# Altium schematic sheet Resolver.SchDoc
size A3
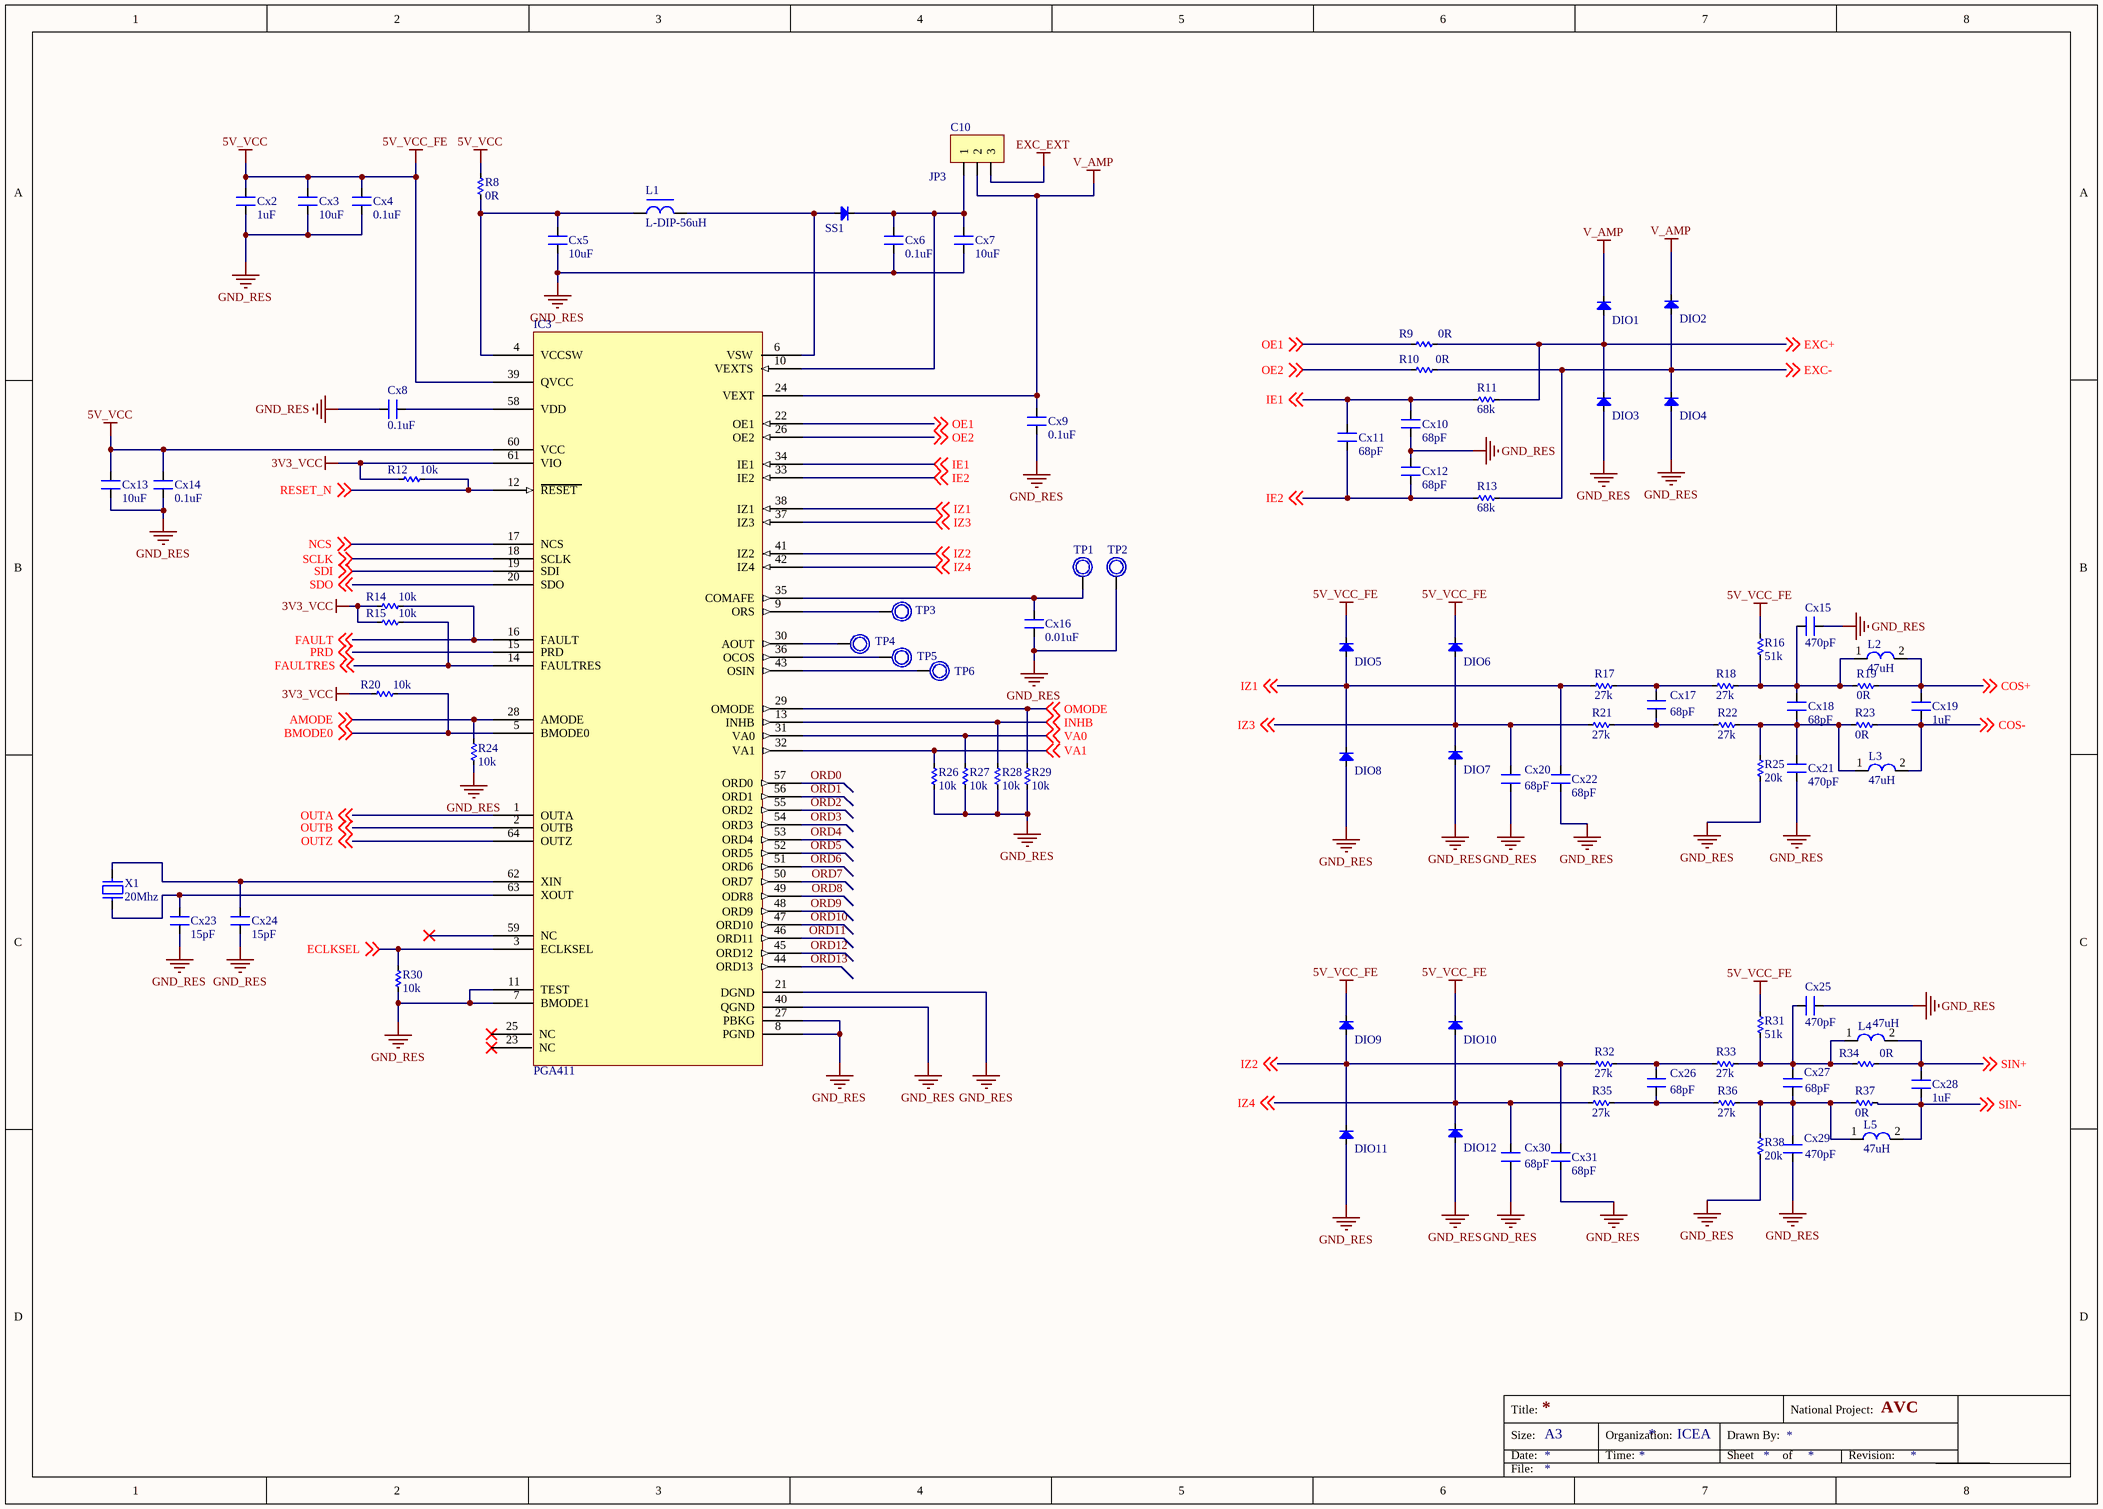
[diagram p0: Resolver.SchDoc]

## Parts
C10  JP3  [JP3-CLOSED]
Cx2  1uF  [CN-SMD-0805]
Cx3  10uF  [CN-SMD-1206]
Cx4  0.1uF  [CN-SMD-0805]
Cx5  10uF  [CN-SMD-1206]
Cx6  0.1uF  [CN-SMD-0805]
Cx7  10uF  [CN-SMD-1206]
Cx8  0.1uF  [CN-SMD-0805]
Cx9  0.1uF  [CN-SMD-0805]
Cx10  68pF  [CN-SMD-0805]
Cx11  68pF  [CN-SMD-0805]
Cx12  68pF  [CN-SMD-0805]
Cx13  10uF  [CN-SMD-1206]
Cx14  0.1uF  [CN-SMD-0805]
Cx15  470pF  [CN-SMD-0805]
Cx16  0.01uF  [CN-SMD-0805]
Cx17  68pF  [CN-SMD-0805]
Cx18  68pF  [CN-SMD-0805]
Cx19  1uF  [CN-SMD-0805]
Cx20  68pF  [CN-SMD-0805]
Cx21  470pF  [CN-SMD-0805]
Cx22  68pF  [CN-SMD-0805]
Cx23  15pF  [CN-SMD-0805]
Cx24  15pF  [CN-SMD-0805]
Cx25  470pF  [CN-SMD-0805]
Cx26  68pF  [CN-SMD-0805]
Cx27  68pF  [CN-SMD-0805]
Cx28  1uF  [CN-SMD-0805]
Cx29  470pF  [CN-SMD-0805]
Cx30  68pF  [CN-SMD-0805]
Cx31  68pF  [CN-SMD-0805]
DIO1  Diode SMD  [DIO-SMD-106]  (value not drawn)
DIO2  Diode SMD  [DIO-SMD-106]  (value not drawn)
DIO3  Diode SMD  [DIO-SMD-106]  (value not drawn)
DIO4  Diode SMD  [DIO-SMD-106]  (value not drawn)
DIO5  Diode SMD  [DIO-SMD-106]  (value not drawn)
DIO6  Diode SMD  [DIO-SMD-106]  (value not drawn)
DIO7  Diode SMD  [DIO-SMD-106]  (value not drawn)
DIO8  Diode SMD  [DIO-SMD-106]  (value not drawn)
DIO9  Diode SMD  [DIO-SMD-106]  (value not drawn)
DIO10  Diode SMD  [DIO-SMD-106]  (value not drawn)
DIO11  Diode SMD  [DIO-SMD-106]  (value not drawn)
DIO12  Diode SMD  [DIO-SMD-106]  (value not drawn)
IC3  PGA411  [PGA411]
L1  L-DIP-56uH  [L-DIP-M-13.5x6]
L2  47uH  [L CD43]
L3  47uH  [L CD43]
L4  47uH  [L CD43]
L5  47uH  [L CD43]
R8  0R  [RES-SMD-0805]
R9  0R  [RES-SMD-0805]
R10  0R  [RES-SMD-0805]
R11  68k  [RES-SMD-0805]
R12  10k  [RES-SMD-0805]
R13  68k  [RES-SMD-0805]
R14  10k  [RES-SMD-0805]
R15  10k  [RES-SMD-0805]
R16  51k  [RES-SMD-0805]
R17  27k  [RES-SMD-0805]
R18  27k  [RES-SMD-0805]
R19  0R  [RES-SMD-0805]
R20  10k  [RES-SMD-0805]
R21  27k  [RES-SMD-0805]
R22  27k  [RES-SMD-0805]
R23  0R  [RES-SMD-0805]
R24  10k  [RES-SMD-0805]
R25  20k  [RES-SMD-0805]
R26  10k  [RES-SMD-0805]
R27  10k  [RES-SMD-0805]
R28  10k  [RES-SMD-0805]
R29  10k  [RES-SMD-0805]
R30  10k  [RES-SMD-0805]
R31  51k  [RES-SMD-0805]
R32  27k  [RES-SMD-0805]
R33  27k  [RES-SMD-0805]
R34  0R  [RES-SMD-0805]
R35  27k  [RES-SMD-0805]
R36  27k  [RES-SMD-0805]
R37  0R  [RES-SMD-0805]
R38  20k  [RES-SMD-0805]
SS1  Diode SMD  [DIO-SMD-106]  (value not drawn)
TP1  TP  [Test Point]  (value not drawn)
TP2  TP  [Test Point]  (value not drawn)
TP3  TP  [Test Point]  (value not drawn)
TP4  TP  [Test Point]  (value not drawn)
TP5  TP  [Test Point]  (value not drawn)
TP6  TP  [Test Point]  (value not drawn)
X1  20Mhz  [XT2 SMD]

## Nets
3V3_VCC: IC3.61(VIO) R12.2 R14.2 R15.2 R20.2
5V_VCC: Cx2.2 Cx3.2 Cx4.2 Cx13.2 Cx14.2 DIO5.2(K) DIO6.2(K) DIO9.2(K) DIO10.2(K) IC3.39(QVCC) IC3.60(VCC) R8.1 R16.1 R31.1  [also labelled 5V_VCC_FE]
EXC_EXT: C10.3
GND_RES: Cx2.1 Cx3.1 Cx4.1 Cx5.1 Cx6.1 Cx7.1 Cx8.2 Cx9.1 Cx10.1 Cx12.2 Cx13.1 Cx14.1 Cx15.1 Cx16.1 Cx20.1 Cx21.1 Cx22.2 Cx23.1 Cx24.1 Cx25.1 Cx29.1 Cx30.1 Cx31.2 DIO3.1(A) DIO4.1(A) DIO7.1(A) DIO8.1(A) DIO11.1(A) DIO12.1(A) IC3.7(BMODE1) IC3.8(PGND) IC3.11(TEST) IC3.21(DGND) IC3.27(PBKG) IC3.40(QGND) R24.2 R25.2 R26.2 R27.2 R28.2 R29.2 R30.2 R38.2 TP2.1
V_AMP: C10.2 Cx9.2 DIO1.2(K) DIO2.2(K) IC3.24(VEXT)
AMODE: IC3.28(AMODE) R24.1 ; off-sheet AMODE
BMODE0: IC3.5(BMODE0) R20.1 ; off-sheet BMODE0
COS+: Cx19.2 L2.2 R19.1 ; off-sheet COS+
COS-: Cx19.1 L3.2 R23.1 ; off-sheet COS-
ECLKSEL: IC3.3(ECLKSEL) R30.1 ; off-sheet ECLKSEL
EXC+: DIO1.1(A) DIO3.2(K) R9.1 R11.1 ; off-sheet EXC+
EXC-: DIO2.1(A) DIO4.2(K) R10.1 R13.1 ; off-sheet EXC-
FAULT: IC3.16(FAULT) R14.1 ; off-sheet FAULT
FAULTRES: IC3.14(FAULTRES) R15.1 ; off-sheet FAULTRES
IE1: Cx10.2 Cx11.2 IC3.34(IE1) R11.2 ; off-sheet IE1
IE2: Cx11.1 Cx12.1 IC3.33(IE2) R13.2 ; off-sheet IE2
INHB: IC3.13(INHB) R28.1 ; off-sheet INHB
IZ1: Cx22.1 DIO5.1(A) DIO8.2(K) IC3.38(IZ1) R17.2 ; off-sheet IZ1
IZ2: Cx31.1 DIO9.1(A) DIO11.2(K) IC3.41(IZ2) R32.2 ; off-sheet IZ2
IZ3: Cx20.2 DIO6.1(A) DIO7.2(K) IC3.37(IZ3) R21.2 ; off-sheet IZ3
IZ4: Cx30.2 DIO10.1(A) DIO12.2(K) IC3.42(IZ4) R35.2 ; off-sheet IZ4
NCS: IC3.17(NCS) ; off-sheet NCS
OE1: IC3.22(OE1) R9.2 ; off-sheet OE1
OE2: IC3.26(OE2) R10.2 ; off-sheet OE2
OMODE: IC3.29(OMODE) R29.1 ; off-sheet OMODE
ORD0: IC3.57(ORD0)
ORD1: IC3.56(ORD1)
ORD2: IC3.55(ORD2)
ORD3: IC3.54(ORD3)
ORD4: IC3.53(ORD4)
ORD5: IC3.52(ORD5)
ORD6: IC3.51(ORD6)
ORD7: IC3.50(ORD7)
ORD8: IC3.49(ODR8)
ORD9: IC3.48(ORD9)
ORD10: IC3.47(ORD10)
ORD11: IC3.46(ORD11)
ORD12: IC3.45(ORD12)
ORD13: IC3.44(ORD13)
OUTA: IC3.1(OUTA) ; off-sheet OUTA
OUTB: IC3.2(OUTB) ; off-sheet OUTB
OUTZ: IC3.64(OUTZ) ; off-sheet OUTZ
PRD: IC3.15(PRD) ; off-sheet PRD
RESET_N: IC3.12(RESET) R12.1 ; off-sheet RESET_N
SCLK: IC3.18(SCLK) ; off-sheet SCLK
SDI: IC3.19(SDI) ; off-sheet SDI
SDO: IC3.20(SDO) ; off-sheet SDO
SIN+: Cx28.2 L4.2 R34.1 ; off-sheet SIN+
SIN-: Cx28.1 L5.2 R37.1 ; off-sheet SIN-
VA0: IC3.31(VA0) R27.1 ; off-sheet VA0
VA1: IC3.32(VA1) R26.1 ; off-sheet VA1
NetC10_1: C10.1 Cx6.2 Cx7.2 IC3.10(VEXTS) SS1.2(K)
NetCx5_2: Cx5.2 IC3.4(VCCSW) L1.1 R8.2
NetCx8_1: Cx8.1 IC3.58(VDD)
NetCx15_2: Cx15.2 Cx18.2 L2.1 R16.2 R18.1 R19.2
NetCx16_2: Cx16.2 IC3.35(COMAFE) TP1.1
NetCx17_1: Cx17.1 R21.1 R22.2
NetCx17_2: Cx17.2 R17.1 R18.2
NetCx18_1: Cx18.1 Cx21.2 L3.1 R22.1 R23.2 R25.1
NetCx23_2: Cx23.2 IC3.63(XOUT) X1.1
NetCx24_2: Cx24.2 IC3.62(XIN) X1.2
NetCx25_2: Cx25.2 Cx27.2 L4.1 R31.2 R33.1 R34.2
NetCx26_1: Cx26.1 R35.1 R36.2
NetCx26_2: Cx26.2 R32.1 R33.2
NetCx27_1: Cx27.1 Cx29.2 L5.1 R36.1 R37.2 R38.1
NetIC3_6: IC3.6(VSW) L1.2 SS1.1(A)
NetIC3_9: IC3.9(ORS) TP3.1
NetIC3_30: IC3.30(AOUT) TP4.1
NetIC3_36: IC3.36(OCOS) TP5.1
NetIC3_43: IC3.43(OSIN) TP6.1

Not connected (* = marked no-connect by the designer): IC3 23(NC)* 25(NC)* 59(NC)*

## Notes on the sheet
- Title:
- Size:
- Date:
- A3
- Organization:
- Time:
- ICEA
- Sheet
- Drawn By:
- of
- National Project:
- Revision:
- AVC
- File:

## Library data of the parts
C10 = JP3: WR-PHD 2.54 mm Angled Socket Header; Manufacturer: W¨¹rth Elektronik eiSos GmbH; partNo: 613003143121; ComponentLink1 Description: Manufacturer; ComponentLink2 Description: Datasheet; NoPins: 03; Created Date: 29 March 2013; ComponentLink1URL: http://www.we-online.com; ComponentLink2URL: http://katalog.we-online.de/em/datasheet/6130xx143121.pdf; Created by: Karrer Zheng
Cx2-Cx31 = CN: Value: 33pF
DIO1-DIO12 SS1 = Diode SMD: Default Diode; Code - JEDEC: DO-214-AB; Value: 1N5007; Published: 8-Jun-2000; Revision: July-2002: Re-released for DXP Platform.; Publisher: Altium Limited
L1 = L-DIP-1: Inductor; Value: 150 mH
L2-L5 = L-SMD-1: partNo: 78477010; Manufacturer: Wurth Elektronik; Inductance: 1.0 μH; ComponentLink1Description: Manufacturer; ComponentLink1URL: http://www.we-online.de; Created by: Baojun Chen; Created Date: Nov.2015; ComponentLink2Description: Datasheet; ComponentLink2URL: http://katalog.we-online.de/pbs/datasheet/78477010.pdf
R8-R38 = Res-SMD: Resistor; Manufacturer: Generic Components; Class: Passive; Published: 08/06/2000; Publisher: Altium Hobart Technology Centre
TP1-TP6 = TP1: Test Point; Value: Test Point
X1 = XT2: Crystal, 32.768 KHz, -40 to 85 degC, 3.2 x 1.5 x 0.9 mm SMD; Value: 4Mhz